# Altium schematic sheet Interface - USB-C.SchDoc: [18] Interface - USB-C
size A4; SheetNumber: 17; SheetTotal: 25
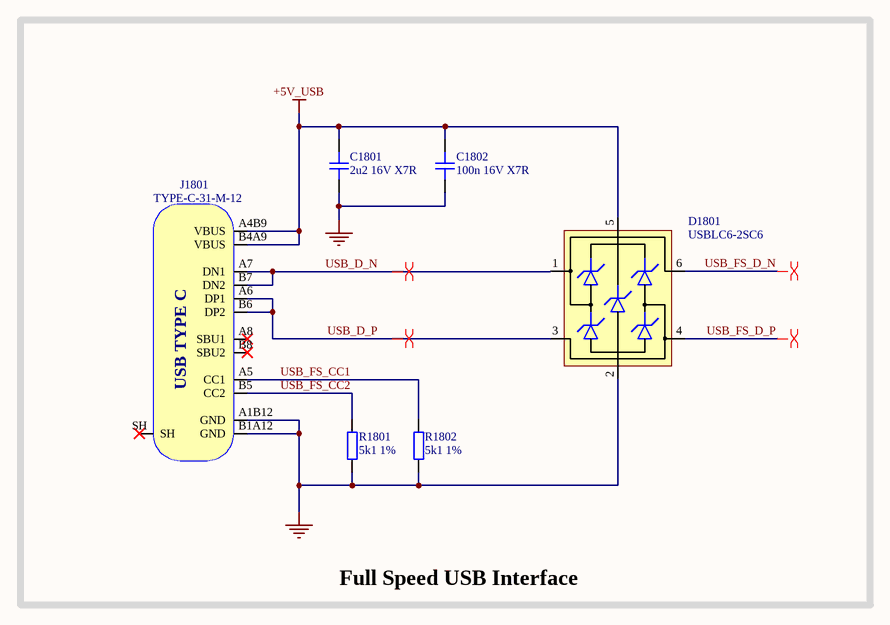
[diagram p0: Interface - USB-C.SchDoc]

## Parts
C1801  2u2 16V X7R  [CAP_0603]
C1802  100n 16V X7R  [CAP_0402]
D1801  USBLC6-2SC6  [SOT-23-6]
J1801  TYPE-C-31-M-12  [TYPE-C-31-M-12]
R1801  5k1 1%  [RES_0402]
R1802  5k1 1%  [RES_0402]

## Blocks framed on the sheet
Full Speed USB Interface: C1801 C1802 D1801 J1801 R1801 R1802

## Nets
+5V_USB: C1801.2 C1802.2 D1801.5(VBUS) J1801.A4B9(VBUS) J1801.B4A9(VBUS)
GND: C1801.1 C1802.1 D1801.2(GND) J1801.A1B12(GND) J1801.B1A12(GND) R1801.1 R1802.1
USB_D_N: D1801.1(IO1) J1801.A7(DN1) J1801.B7(DN2)
USB_D_P: D1801.3(IO2) J1801.A6(DP1) J1801.B6(DP2)
USB_FS_CC1: J1801.A5(CC1) R1802.2
USB_FS_CC2: J1801.B5(CC2) R1801.2
USB_FS_D_N: D1801.6(IO1)
USB_FS_D_P: D1801.4(IO2)

Not connected (* = marked no-connect by the designer): J1801 A8(SBU1)* B8(SBU2)* SH*

## Layout directives
differential pair: USB_D_N, USB_D_P, USB_FS_D_N, USB_FS_D_P

## Notes on the sheet
- Title:
- Drawn By:
- Page Contents:
- Checked By:
- Size:
- Date:
- File:
- License:
- Email:
- A4
- Number:
- Time:
- Revision:
- Sheet
- Website:
- of
- (in symbol TYPE-C-31-M-12) USB TYPE C

## Library data of the parts
C1801 = CAP_0603: Capacitor SMD 0603; Manufacturer: YAGEO; Manufacturer Part Number: CC0603KRX7R7BB225; Distributor Link: www.lcsc.com; LCSC: C914769; Rating: *; Dielectric: *
C1802 = CAP_0402: Capacitor SMD 0402; Manufacturer: YAGEO; Manufacturer Part Number: CC0402JRX7R7BB104; Distributor Link: www.lcsc.com; LCSC: C541464; Rating: *; Dielectric: *
D1801 = USBLC6-2SC6: Low-Capacitance ESD Protection USB; Manufacturer: STMicroelectronics; Manufacturer Part Number: USBLC6-2SC6; Distributor Link: https://www.mouser.de/ProductDetail/STMicroelectronics/USBLC6-2SC6?qs=po45yt2pPpu%2FhNIlwQdTlg%3D%3D
J1801 = TYPE-C-31-M-12: USB Type C Connector Horizontal SMT; Manufacturer: Koren Hroparts; Manufacturer Part Number: TYPE-C-31-M-12
R1801 R1802 = RES_0402: Resistor SMD 0402; Manufacturer: PANASONIC; Manufacturer Part Number: ERJ2GEJ512X; Distributor Link: www.lcsc.com; LCSC: C413002